# EAGLE design tracer-jigu (EAGLE 9.6.2)
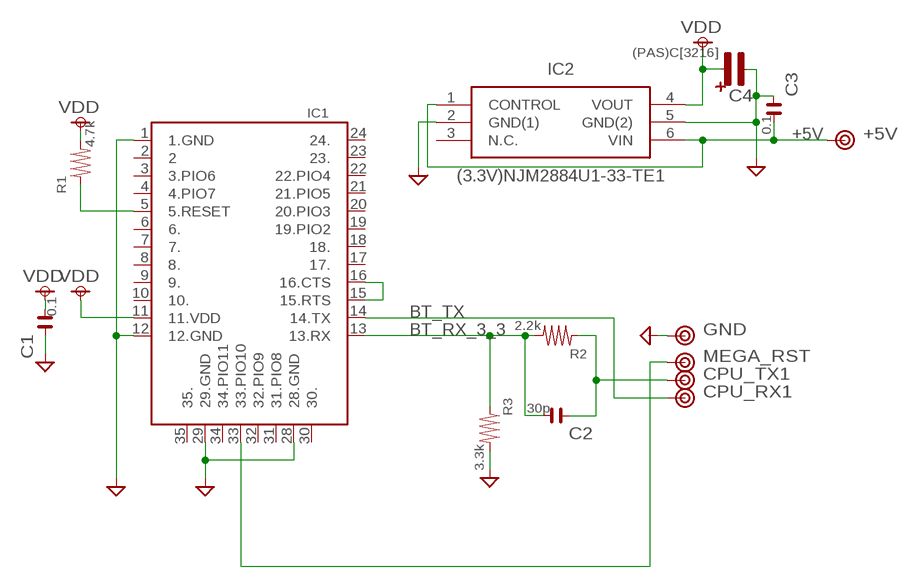
[diagram p0: schematic, sheet 1]

## Parts
+5V  TP-HOLE  [TP-HOLE]
C1  0.1  (PAS)C[1608]  [1608NEW]
C2  30p  (PAS)C[1608]  [1608NEW]
C3  0.1  (PAS)C[1608]  [1608NEW]
C4  (PAS)C[3216]  [3216]
CPU_RX1  TP-HOLE  [TP-HOLE]
CPU_TX1  TP-HOLE  [TP-HOLE]
GND  TP-HOLE  [TP-HOLE]
IC1  RN-42-BT  [RN42-BT-PAC]
IC2  (3.3V)NJM2884U1-33-TE1  [SOT-89-5-1]
MEGA_RST  TP-HOLE  [TP-HOLE]
R1  4.7k  (PAS)R[1608]  [1608NEW]
R2  2.2k  (PAS)R[1608]  [1608NEW]
R3  3.3k  (PAS)R[1608]  [1608NEW]

## Nets
+5V: +5V.1 C3.2 IC2.1(CONTROL) IC2.6(VIN)
BT_RX_3_3: C2.2 IC1.13(13.RX) R2.2 R3.1
BT_TX: CPU_RX1.1 IC1.14(14.TX)
GND: C1.1 C3.1 C4.2(M) GND.1 IC1.1(1.GND) IC1.12(12.GND) IC1.28(28.GND) IC1.29(29.GND) IC2.2(GND(1)) IC2.5(GND(2)) R3.2
N$2: IC1.33(33.PIO10) MEGA_RST.1
N$3: IC1.15(15.RTS) IC1.16(16.CTS)
N$4: C2.1 CPU_TX1.1 R2.1
N$5: IC1.5(5.RESET) R1.1
VDD: C1.2 C4.1(P) IC1.11(11.VDD) IC2.4(VOUT) R1.2
Unconnected: IC1.2 IC1.3(3.PIO6) IC1.4(4.PIO7) IC1.6(6.) IC1.7(7.) IC1.8(8.) IC1.9(9.) IC1.10(10.) IC1.17(17.) IC1.18(18.) IC1.19(19.PIO2) IC1.20(20.PIO3) IC1.21(21.PIO5) IC1.22(22.PIO4) IC1.23(23.) IC1.24(24.) IC1.30(30.) IC1.31(31.PIO8) IC1.32(32.PIO9) IC1.34(34.PIO11) IC1.35(35.) IC2.3(N.C.)

## Library data of the parts
+5V CPU_RX1 CPU_TX1 GND MEGA_RST = myEagleParts8:TP-HOLE
C1-C3 = myEagleParts8:(PAS)C[1608]
C4 = myEagleParts8:(PAS)C[3216]
IC1 = myEagleParts:RN-42-BT
IC2 = myEagleParts8:(3.3V)NJM2884U1-33-TE1: Low Dropout Voltage Regulator New Japan Radio NJM2884U1-33-TE1, LDO Voltage Regulator, 0.65A, 3.3 V 1%, 5-Pin SOT-89 <https://componentsearchengine.com/Images/3/NJM2884U1-33-TE1.jpg> Source: Datasheet <http://www.njr.com/semicon/PDF/NJM2884_2884A_E.pdf>; DESCRIPTION: Low Dropout Voltage Regulator New Japan Radio NJM2884U1-33-TE1, LDO Voltage Regulator, 0.65A, 3.3 V 1%, 5-Pin SOT-89; HEIGHT: mm; MANUFACTURER_NAME: New Japan Radio; MANUFACTURER_PART_NUMBER: NJM2884U1-33-TE1; RS_PART_NUMBER: 7139366P; SUPPLIER_NAME: RS
R1-R3 = myEagleParts8:(PAS)R[1608]

## Net classes
0 default: width 0.203 mm, drill 0.152 mm, clearance 0.203 mm

## Board
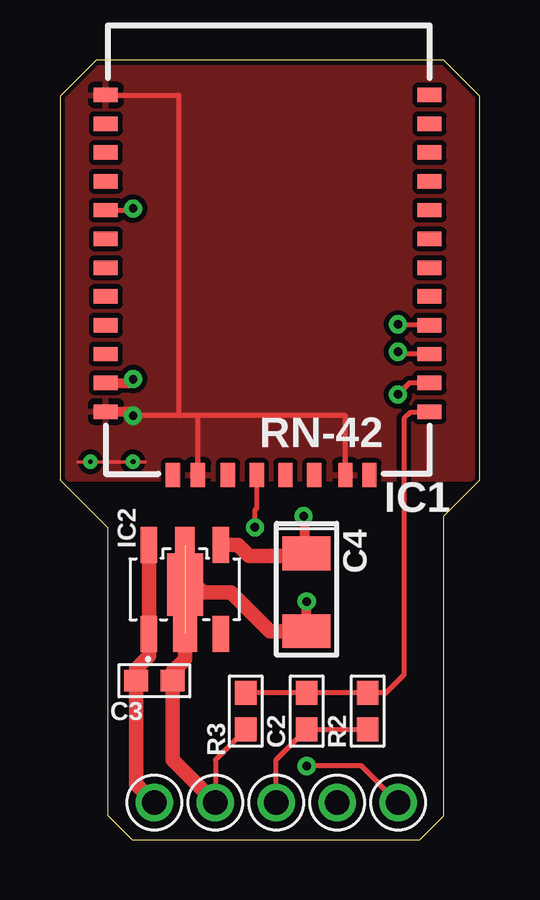
[diagram p1: board, top side]
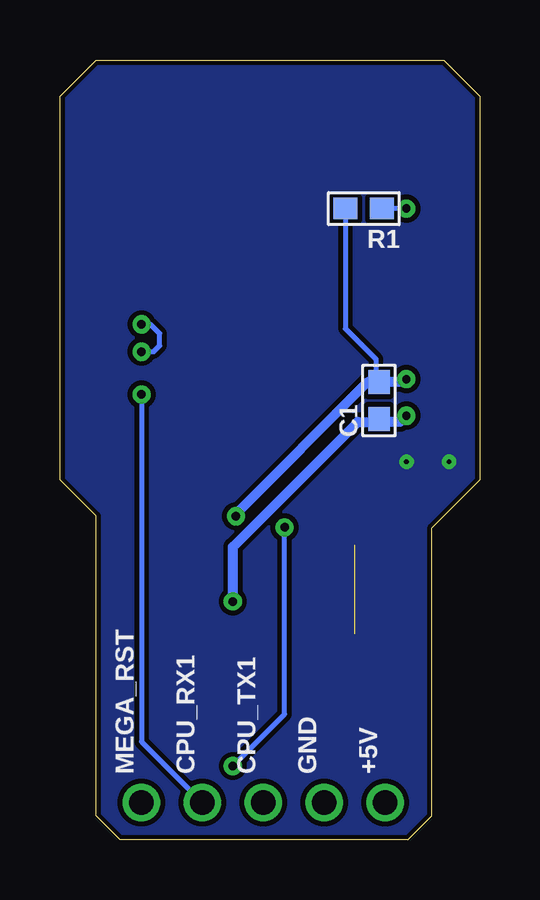
[diagram p2: board, bottom side, seen from below]

Size 17.5 x 32.5 mm. Coordinates in mm from the lower left corner, seen from the top.
Outline: 0,31 0,15 2,13 2,1 3,0 15,0 16,1 16,13.5 17.5,15 17.5,31 16,32.5 1.5,32.5 0,31
Copper layers (1*16): Top 0.035mm / dielectric 1.5mm / Bottom 0.035mm
Design rules "PCBGoGo": minimum track width 6mil, minimum drill 0.2mm, track to track 6mil, track to pad 6mil, pad to pad 6mil, via to via 6mil, smd to smd 6mil, copper to edge 0.2mm, drill to drill 6mil, minimum pad ring 10mil, minimum via ring 8mil, stop-mask expansion 4mil, vias tented up to drill 0mil, thermal gap 10mil

### Footprints (pad centres in the part's own frame; a part is rotated, then mirrored left to right if it is on the bottom)
TP-HOLE = drill 1.016 pad 1.575: 1 0,0
1608NEW = smd 1 x 0.9: 1 -0.766,0; 2 0.766,0
3216 = smd 1.4 x 2: 1 -1.496,0; 2 1.75,0
RN42-BT-PAC = smd 1 x 0.6: 1 0,16.8; 2 0,15.6; 3 0,14.4; 4 0,13.2; 5 0,12; 6 0,10.8; 7 0,9.6; 8 0,8.4; 9 0,7.2; 10 0,6; 11 0,4.8; 12 0,3.6; 13 13.5,3.6; 14 13.5,4.8; 15 13.5,6; 16 13.5,7.2; 17 13.5,8.4; 18 13.5,9.6; 19 13.5,10.8; 20 13.5,12; 21 13.5,13.2; 22 13.5,14.4; 23 13.5,15.6; 24 13.5,16.8 | smd 0.6 x 1: 28 10,0.95; 29 3.85,0.95; 30 11,0.95; 31 8.7,0.95; 32 7.5,0.95; 33 6.3,0.95; 34 5.1,0.95; 35 2.8,0.95
SOT-89-5-1 = smd 0.7 x 1.5: 1 -1.5,-1.85; 3 1.5,-1.85; 4 1.5,1.85; 6 -1.5,1.85 | smd 1 x 1.5: 2 0,-1.85 | smd 0.8 x 1.5: 5 0,1.85 | smd 1.5 x 2.6: 7 0,0.2

### Placement (x,y rotation side)
+5V  3.94,1.54 0 top
C1  4.19,18.3 90 bottom
C2  10.29,5.35 90 top
C3  3.94,6.62 180 top
C4  10.29,10.43 270 top
CPU_RX1  11.56,1.54 0 top
CPU_TX1  9.02,1.54 90 top
GND  6.48,1.54 0 top
IC1  1.91,14.24 0 top
IC2  5.21,10.43 0 top
MEGA_RST  14.1,1.54 0 top
R1  4.83,26.3 180 bottom
R2  12.83,5.35 90 top
R3  7.75,5.35 270 top

### Tracks (layer width: path | path; a pad name or v marks a point on that pad's centre or on a via)
+5V
  Top 0.305: C3.2 3.17,7.12
  Top 0.61: +5V.1 3.17,2.31 C3.2 | 3.17,7.12 3.71,7.66 IC2.1 IC2.6
BETA  (via drill 0.2 pad 0.3)
  other vias: 1.27,15.75 3.05,15.75
  pour Bottom: -2.54,35.56 20.32,35.56 20.32,-2.54 -2.54,-2.54
BT_RX_3_3
  Top 0.203: R3.1 C2.2 R2.2 13.59,6.11 14.35,6.87 14.35,17.54 14.61,17.8 15.36,17.8 IC1.13
BT_TX  (via drill 0.35 pad 0.3)
  Top 0.203: IC1.14 14.58,19.04 v14.1,18.56
  Bottom 0.203: v14.1,18.56 14.1,4.08 CPU_RX1.1
GND  (via drill 0.35 pad 0.3)  (1 unrouted)
  Top 0.152: 0.76,15.75 3.56,15.75
  Top 0.203: R3.2 6.48,3.31 GND.1 | IC1.1 4.96,31.04 4.96,17.67 | 4.96,17.67 v3.05,17.67 | IC1.29 5.76,17.67 | 5.76,17.67 4.96,17.67 | IC1.28 11.91,17.67 5.76,17.67
  Top 0.305: C3.1 4.71,7 | IC2.5 5.21,11.06
  Top 0.406: IC1.12 2.88,17.84 v3.05,17.67 | C4.2 v10.29,9.92
  Top 0.61: GND.1 4.71,3.31 C3.1 | 4.71,7 5.21,7.51 IC2.2 | 5.21,11.06 5.97,10.3 7.14,10.3 8.77,8.68 C4.2
  Bottom 0.406: v3.05,17.67 3.31,17.41 4.07,17.41 | 4.07,17.41 C1.1 | 4.07,17.41 5.08,17.41 10.29,12.21 v10.29,9.92
  pour Top: -1,15 19,15 19,33 -1,33
N$2  (via drill 0.35 pad 0.3)
  Top 0.203: MEGA_RST.1 12.58,3.06 v10.29,3.06 | v8.13,13.01 8.13,13.73 8.21,13.81 IC1.33
  Bottom 0.203: v10.29,3.06 8.13,5.22 v8.13,13.01
N$3  (via drill 0.35 pad 0.3)
  Top 0.203: IC1.15 14.23,20.24 14.23,20.34 v14.1,20.34 | v14.1,21.48 15.37,21.48 IC1.16
  Bottom 0.203: v14.1,20.34 13.59,20.34 13.34,20.59 13.34,21.1 13.72,21.48 v14.1,21.48
N$4
  Top 0.203: CPU_TX1.1 9.02,3.31 C2.1 R2.1
N$5  (via drill 0.35 pad 0.3)
  Top 0.203: IC1.5 2.73,26.24 2.8,26.3 v3.05,26.3
  Bottom 0.203: v3.05,26.3 R1.1
VDD  (via drill 0.35 pad 0.3)
  Top 0.305: 10.19,11.83 C4.1
  Top 0.406: IC1.11 2.9,19.04 v3.05,19.19 | v10.16,13.48 10.19,13.45 10.19,11.83
  Top 0.61: IC2.4 7.43,12.28 7.88,11.83 10.19,11.83
  Bottom 0.203: R1.2 5.59,21.3 4.32,20.03 4.32,19.07
  Bottom 0.406: v3.05,19.19 3.17,19.07 4.07,19.07 C1.2 | C1.2 4.32,19.07 | C1.2 4.67,19.07 10.16,13.58 v10.16,13.48